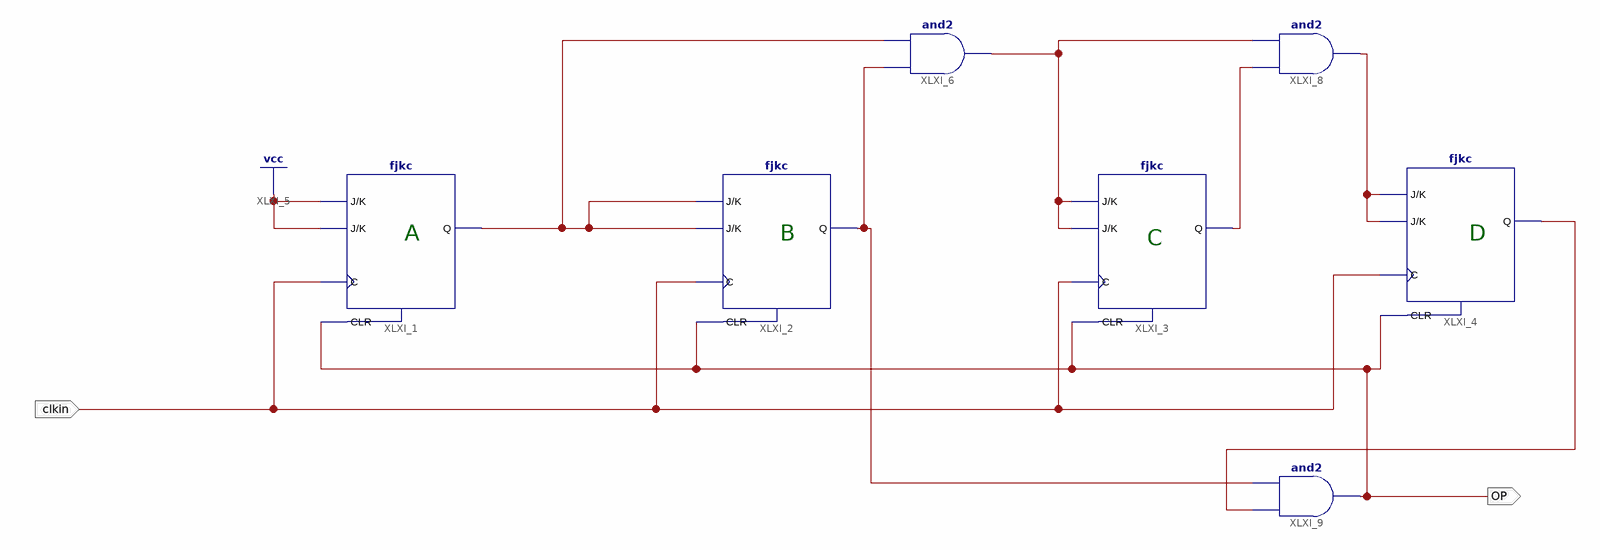
[diagram p0: schematic sheet 1]
// Xilinx ISE schematic Mod10.sch (spartan6) as structural Verilog: 7 symbols, 2 ports
module Mod10 (
  input  clkin,
  output OP
);

  wire XLXN_4, XLXN_5, XLXN_14, XLXN_15, XLXN_16, XLXN_23;

  fjkc XLXI_1 (.C(clkin), .CLR(OP), .J(1'b1), .K(1'b1), .Q(XLXN_4));
  fjkc XLXI_2 (.C(clkin), .CLR(OP), .J(XLXN_4), .K(XLXN_4), .Q(XLXN_5));
  fjkc XLXI_3 (.C(clkin), .CLR(OP), .J(XLXN_14), .K(XLXN_14), .Q(XLXN_15));
  fjkc XLXI_4 (.C(clkin), .CLR(OP), .J(XLXN_16), .K(XLXN_16), .Q(XLXN_23));
  and XLXI_6 (XLXN_14, XLXN_5, XLXN_4);
  and XLXI_8 (XLXN_16, XLXN_15, XLXN_14);
  and XLXI_9 (OP, XLXN_23, XLXN_5);

  // Notes on the sheet:
  //   A
  //   B
  //   D
  //   C
endmodule
